# EAGLE design UpTo11.FrontPanel (EAGLE 7.6.0)
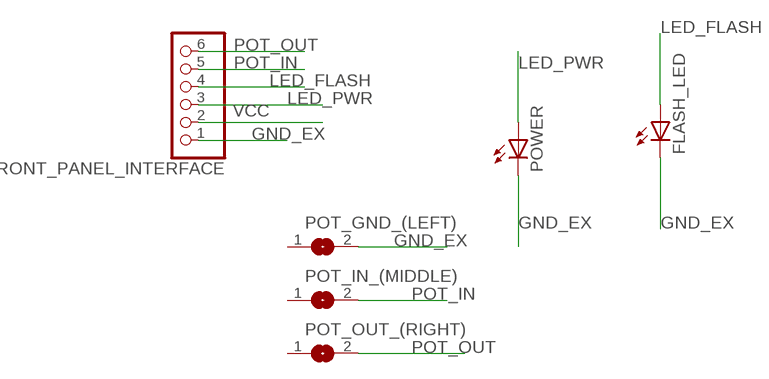
[diagram p0: schematic, sheet 1]

## Parts
FLASH_LED  LED5MM  [LED5MM]
FRONT_PANEL_INTERFACE  PINHD-1X6  [1X06]
POT_GND_(LEFT)  SOLDERJUMPERREFLOW  [SOLDERJUMPER_REFLOW]
POT_IN_(MIDDLE)  SOLDERJUMPERREFLOW  [SOLDERJUMPER_REFLOW]
POT_OUT_(RIGHT)  SOLDERJUMPERREFLOW  [SOLDERJUMPER_REFLOW]
POWER  LEDSMT1206  [1206]

## Nets
GND_EX: FLASH_LED.K(C) FRONT_PANEL_INTERFACE.1 POT_GND_(LEFT).2 POWER.C
LED_FLASH: FLASH_LED.A FRONT_PANEL_INTERFACE.4
LED_PWR: FRONT_PANEL_INTERFACE.3 POWER.A
POT_IN: FRONT_PANEL_INTERFACE.5 POT_IN_(MIDDLE).2
POT_OUT: FRONT_PANEL_INTERFACE.6 POT_OUT_(RIGHT).2
VCC: FRONT_PANEL_INTERFACE.2
Unconnected: POT_GND_(LEFT).1 POT_IN_(MIDDLE).1 POT_OUT_(RIGHT).1

## Library data of the parts
FLASH_LED POWER = adafruit:LED: LED OSRAM: - CHIPLED LG R971, LG N971, LY N971, LG Q971, LY Q971, LO R971, LY R971 LH N974, LH R974 LS Q976, LO Q976, LY Q976 LO Q996 - Hyper CHIPLED LW Q18S LB Q993, LB Q99A, LB R99A - SideLED LS A670, LO A670, LY A670, LG A670, LP A670 LB A673, LV A673, LT A673, LW A673 LH A674 LY A675 LS A676, LA A676, LO A676, LY A676, LW A676 LS A679, LY A679, LG A679 - Hyper Micro SIDELED® LS Y876, LA Y876, LO Y876, LY Y876 LT Y87S - SmartLED LW L88C, LW L88S LB L89C, LB L89S, LG L890 LS L89K, LO L89K, LY L89K LS L896, LA L896, LO L896, LY L896 - TOPLED LS T670, LO T670, LY T670, LG T670, LP T670 LSG T670, LSP T670, LSY T670, LOP T670, LYG T670 LG T671, LOG T671, LSG T671 LB T673, LV T673, LT T673, LW T673 LH T674 LS T676, LA T676, LO T676, LY T676, LB T676, LH T676, LSB T676, LW T676 LB T67C, LV T67C, LT T67C, LS T67K, LO T67K, LY T67K, LW E67C LS E67B, LA E67B, LO E67B, LY E67B, LB E67C, LV E67C, LT E67C LW T67C LS T679, LY T679, LG T679 LS T770, LO T770, LY T770, LG T770, LP T770 LB T773, LV T773, LT T773, LW T773 LH T774 LS E675, LA E675, LY E675, LS T675 LS T776, LA T776, LO T776, LY T776, LB T776 LHGB T686 LT T68C, LB T68C - Hyper Mini TOPLED® LB M676 - Mini TOPLED Santana® LG M470 LS M47K, LO M47K, LY M47K Source: http://www.osram.convergy.de/
FRONT_PANEL_INTERFACE = adafruit:PINHD-1X6: PIN HEADER
POT_GND_(LEFT) POT_IN_(MIDDLE) POT_OUT_(RIGHT) = microbuilder:SOLDERJUMPER: SMD Solder JUMPER Solder the two pads together to create a connection, or remove the solder to break it. REFLOW - Use this footprint for solder paste and reflow ovens. WAVE - Use this footprint for hand-soldering (larger pads). CLOSED - Has a trace between the two pads to ensure it is closed by default. The trace needs to be cut to disable the jumper, and can be closed again by creating a solder bridge between the two pads.

## Net classes
0 default: clearance 0.205 mm

## Board
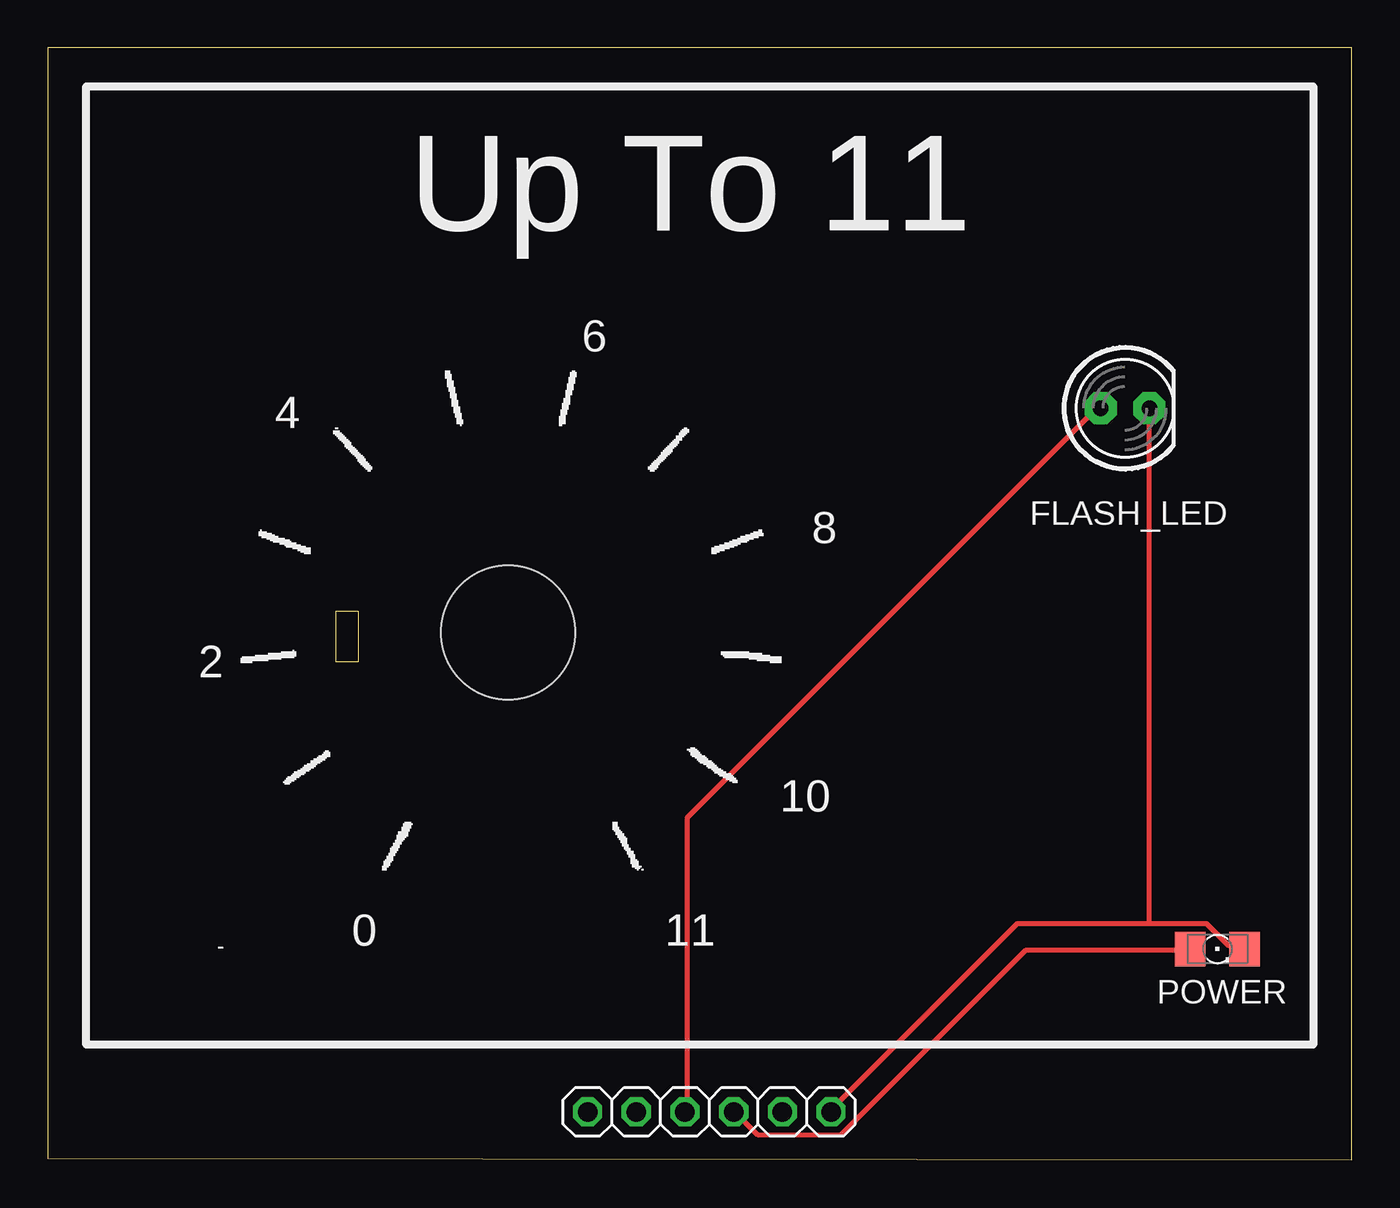
[diagram p1: board, top side]
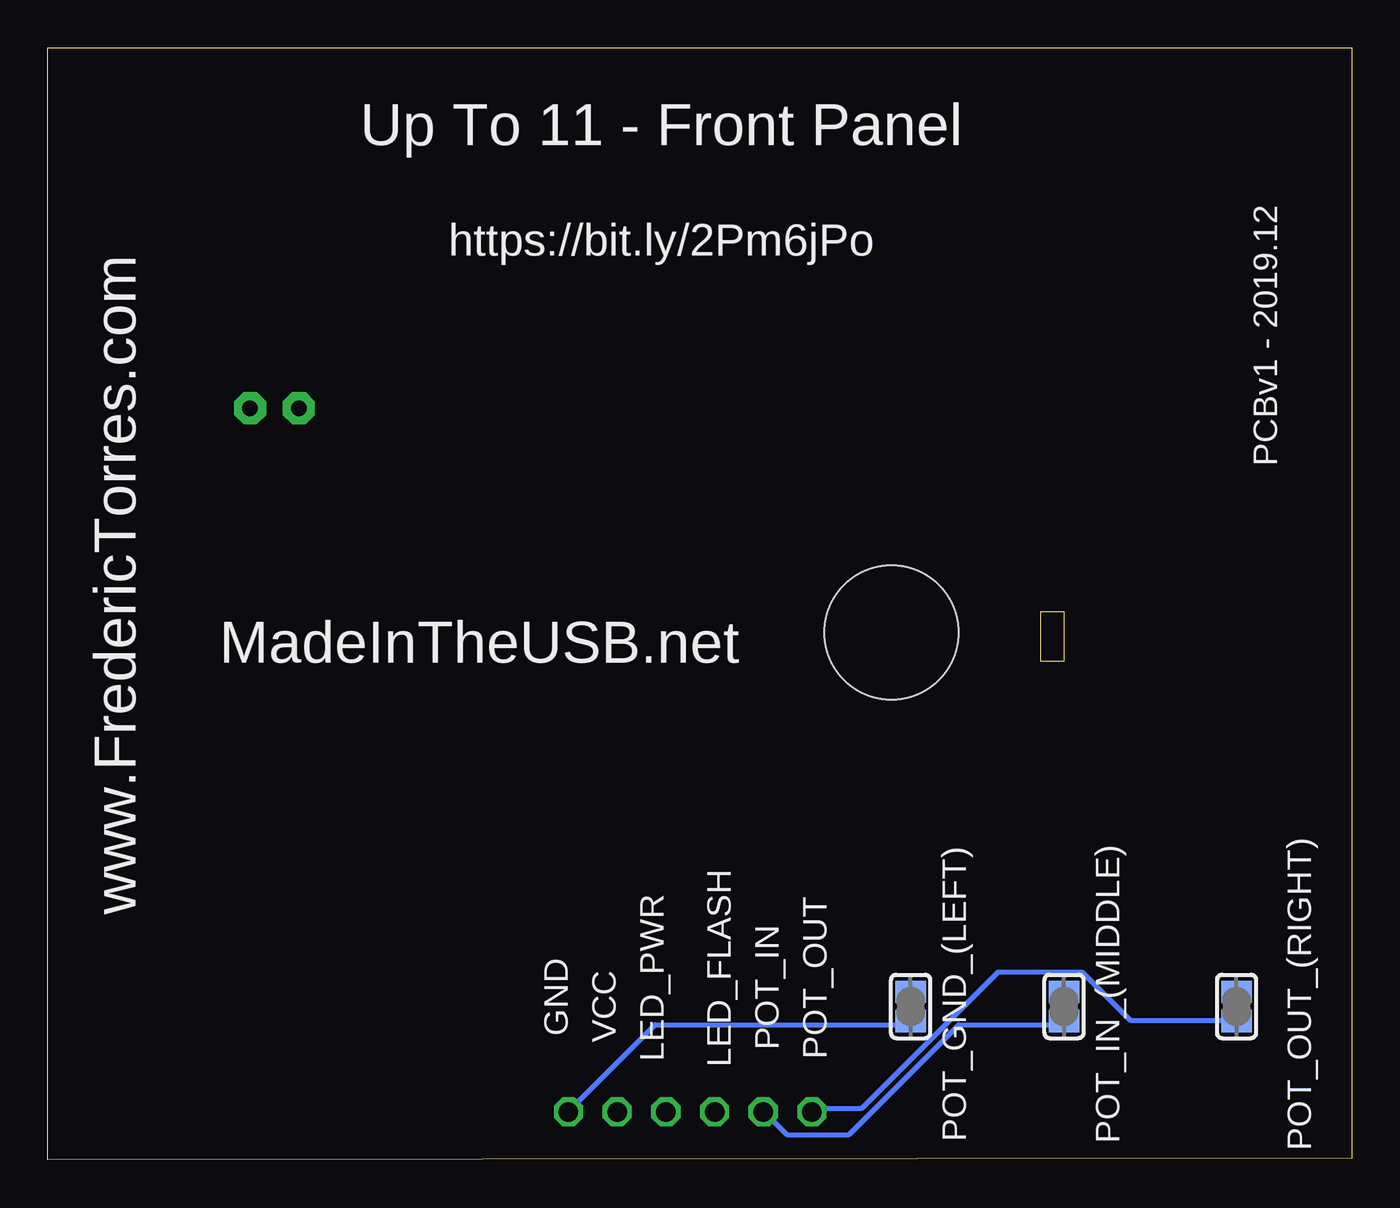
[diagram p2: board, bottom side, seen from below]

Size 68 x 58 mm. Coordinates in mm from the lower left corner, seen from the top.
Outline: 0,0.09 68,0 68,58 0,58 0,0.09
Copper layers (1*16): Top 0.035mm / dielectric 1.5mm / Bottom 0.035mm
Design rules "default": minimum track width 10mil, minimum drill 24mil, track to track 8mil, track to pad 8mil, pad to pad 8mil, via to via 8mil, smd to smd 8mil, copper to edge 40mil, drill to drill 8mil, minimum pad ring 10mil, minimum via ring 8mil, stop-mask expansion 4mil, vias tented up to drill 0mil, thermal gap 10mil
Holes 7 mm at 24,27.5
Milling: area 15,26 to 16.2,28.6

### Footprints (pad centres in the part's own frame; a part is rotated, then mirrored left to right if it is on the bottom)
LED5MM = drill 0.813 pad 1.676 octagon: A -1.27,0; K 1.27,0
1X06 = drill 1.016 octagon: 1 -6.35,0; 2 -3.81,0; 3 -1.27,0; 4 1.27,0; 5 3.81,0; 6 6.35,0
SOLDERJUMPER_REFLOW = smd 1.168 x 1.6: 1 -0.762,0; 2 0.762,0
1206 = smd 1.6 x 1.803: A -1.422,0; C 1.422,0

### Placement (x,y rotation side)
FLASH_LED  56.19,39.21 0 top
FRONT_PANEL_INTERFACE  34.5,2.5 180 top
POT_GND_(LEFT)  23,8 270 bottom
POT_IN_(MIDDLE)  15,8 270 bottom
POT_OUT_(RIGHT)  6,8 270 bottom
POWER  61,11 0 top

### Tracks (layer width: path | path; a pad name or v marks a point on that pad's centre or on a via)
GND_EX
  Top 0.254: 57.44,12.33 50.56,12.33 40.92,2.69 FRONT_PANEL_INTERFACE.1 | 57.44,12.33 60.42,12.33 61.57,11.18 62.26,11.18 POWER.C | 57.44,12.33 57.44,39.18 FLASH_LED.K
  Bottom 0.254: POT_GND_(LEFT).2 23.02,7.05 36.33,7.05 40.69,2.69 FRONT_PANEL_INTERFACE.1
LED_FLASH
  Top 0.254: FRONT_PANEL_INTERFACE.4 33.34,2.69 33.34,17.84 54.69,39.18 FLASH_LED.A
LED_PWR
  Top 0.254: POWER.A 59.51,10.95 51.01,10.95 41.38,1.31 37.02,1.31 35.87,2.46 FRONT_PANEL_INTERFACE.3
POT_IN
  Bottom 0.254: POT_IN_(MIDDLE).2 15.21,7.05 20.49,7.05 26.23,1.31 29.44,1.31 30.59,2.46 FRONT_PANEL_INTERFACE.5
POT_OUT
  Bottom 0.254: POT_OUT_(RIGHT).2 6.03,7.28 11.54,7.28 14.07,9.8 18.43,9.8 25.54,2.69 28.06,2.69 FRONT_PANEL_INTERFACE.6

### Text on the board
tPlace: C:/DVT/MadeInTheUSB.PCB/EXTENSIONS/Analog/UpTo11/FrontPanel/Amplifier Legend to 11.mask.bmp
tNames: Up To 11 | 6 | 4 | 8 | 2 | 10 | 0 | 11
bNames: Up To 11 - Front Panel | https://bit.ly/2Pm6jPo | PCBv1 - 2019.12 | www.FredericTorres.com | MadeInTheUSB.net | POT_OUT | LED_FLASH | LED_PWR | POT_IN | VCC | GND